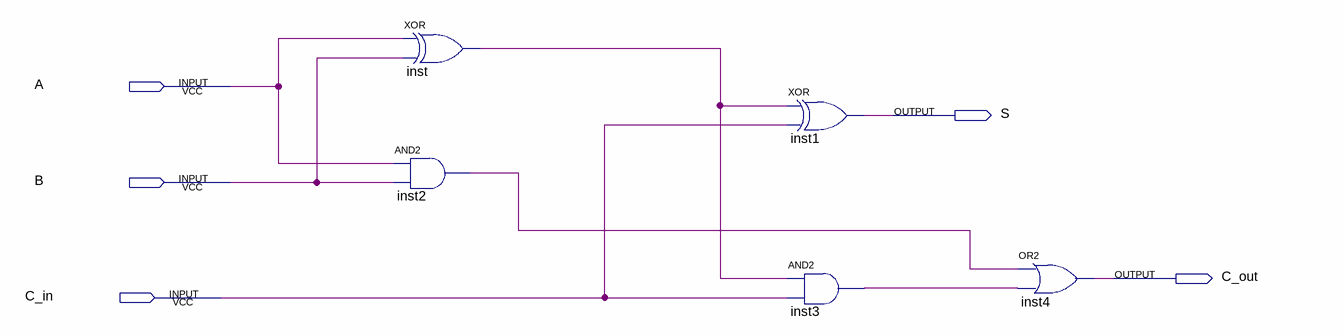
[diagram p0: schematic sheet]
// Quartus schematic FullAdder.bdf as structural Verilog: 5 symbols, 5 pins
module FullAdder (
  input  A,
  input  B,
  input  C_in,
  output S,
  output C_out
);

  wire inst2_out, inst3_out, inst_out;

  xor inst (inst_out, A, B);
  and inst2 (inst2_out, A, B);
  xor inst1 (S, inst_out, C_in);
  and inst3 (inst3_out, inst_out, C_in);
  or inst4 (C_out, inst2_out, inst3_out);
endmodule
